# EAGLE design MCPL3-AC-V (EAGLE 9.6.2)
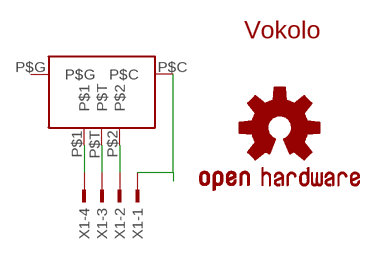
[diagram p0: schematic, sheet 1]

## Parts
LOGO1  OSHW-LOGOMINI  [OSHW-LOGO-MINI]
U$1  MCPL3-AC-VWIDE  [MCPL3-AC-V-EDITED]
U$2  LOGO_VOKOLO12MM  [LOGO_VOKOLO_9,8MM]
X1  TSW-104-07-G-S  [TSW-104-XX-G-S]

## Nets
N$1: U$1.P$1 X1.4
N$2: U$1.P$T X1.3
N$3: U$1.P$2 X1.2
N$4: U$1.P$C X1.1
Unconnected: U$1.P$G

## Library data of the parts
LOGO1 = SparkFun-Aesthetics:OSHW-LOGO: Open-Source Hardware (OSHW) Logo This logo indicates the piece of hardware it is found on incorporates a OSHW license and/or adheres to the definition of open source hardware found here: http://freedomdefined.org/OSHW
U$1 = MCPL3-AC-V:MCPL3-AC-V
U$2 = logo_vokolo:LOGO_VOKOLO: logo vokolo
X1 = con-samtec:TSW-104-*-G-S: THROUGH-HOLE .025" SQ POST HEADER Source: Samtec TSW.pdf; MF: Samtec Inc.; MPN: TSW-104-07-G-S

## Board
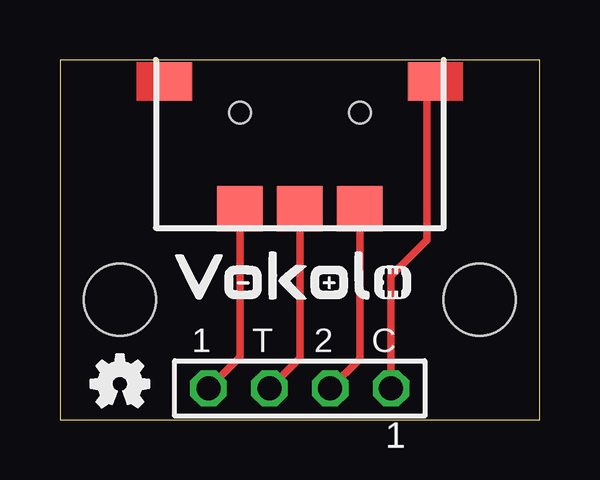
[diagram p1: board, top side]

Size 20 x 15 mm. Coordinates in mm from the lower left corner, seen from the top.
Outline: 0,0 20,0 20,15 0,15 0,0
Copper layers (1*16): Top 0.035mm / dielectric 1.5mm / Bottom 0.035mm
Design rules "default": minimum track width 6mil, minimum drill 0.3mm, track to track 6mil, track to pad 6mil, pad to pad 6mil, via to via 6mil, smd to smd 6mil, copper to edge 20mil, drill to drill 6mil, minimum pad ring 10mil, minimum via ring 8mil, stop-mask expansion 4mil, vias tented up to drill 0.3mm, thermal gap 12mil
Holes 3 mm at 2.5,5 17.5,5

### Footprints (pad centres in the part's own frame; a part is rotated, then mirrored left to right if it is on the bottom)
MCPL3-AC-V-EDITED = smd 1.9 x 1.9: P$1 -2.5,-4; P$2 2.5,-4; P$T 0,-4 | smd 1.6 x 1.6: P$C 5.3,1.3; P$G -5.3,1.3 | hole 0.9: -2.5,0; 2.5,0
TSW-104-XX-G-S = drill 1 pad 1.5 octagon: 1 3.81,0; 2 1.27,0; 3 -1.27,0; 4 -3.81,0

### Placement (x,y rotation side)
LOGO1  2.5,1.5 0 top
U$1  10,12.8 0 top
U$2  5.8,5 0 top
X1  10,1.3 0 top

### Tracks (layer width: path | path; a pad name or v marks a point on that pad's centre or on a via)
N$1
  Top 0.305: U$1.P$1 7.5,2.61 X1.4
N$2
  Top 0.305: U$1.P$T 10,2.57 X1.3
N$3
  Top 0.305: U$1.P$2 12.5,2.53 X1.2
N$4
  Top 0.305: 15.08,13.48 U$1.P$C 15.3,7.49 13.81,6 X1.1
(copper drawn outside any net)
  shapes: Top area x2

### Text on the board
tSilk: 1 | T | 2 | C